# EAGLE design WS2803_7segs_discrete (EAGLE 7.1.0)
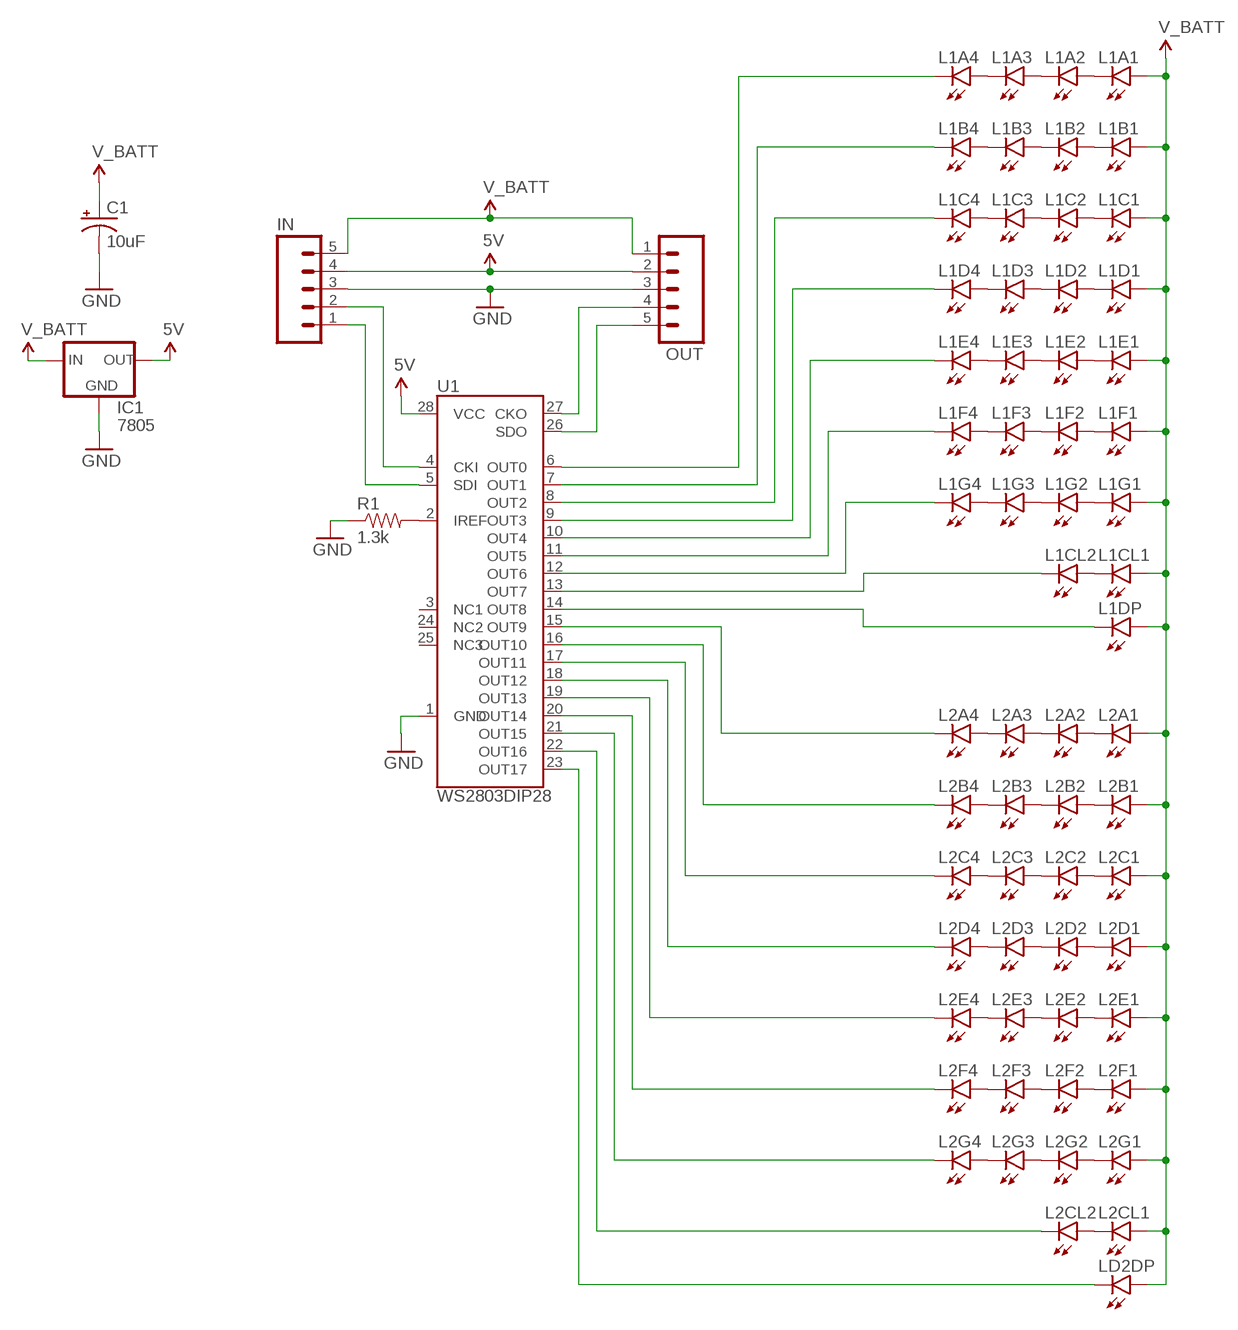
[diagram p0: schematic, sheet 1]

## Parts
C1  10uF  CAP_POLPTH2  [CPOL-RADIAL-10UF-25V]
IC1  7805  V_REG_78XXTO-92_FIXED  [TO-92]
IN  M05PTH  [1X05]
L1A1  LED5MM  [LED5MM]
L1A2  LED5MM  [LED5MM]
L1A3  LED5MM  [LED5MM]
L1A4  LED5MM  [LED5MM]
L1B1  LED5MM  [LED5MM]
L1B2  LED5MM  [LED5MM]
L1B3  LED5MM  [LED5MM]
L1B4  LED5MM  [LED5MM]
L1C1  LED5MM  [LED5MM]
L1C2  LED5MM  [LED5MM]
L1C3  LED5MM  [LED5MM]
L1C4  LED5MM  [LED5MM]
L1CL1  LED5MM  [LED5MM]
L1CL2  LED5MM  [LED5MM]
L1D1  LED5MM  [LED5MM]
L1D2  LED5MM  [LED5MM]
L1D3  LED5MM  [LED5MM]
L1D4  LED5MM  [LED5MM]
L1DP  LED5MM  [LED5MM]
L1E1  LED5MM  [LED5MM]
L1E2  LED5MM  [LED5MM]
L1E3  LED5MM  [LED5MM]
L1E4  LED5MM  [LED5MM]
L1F1  LED5MM  [LED5MM]
L1F2  LED5MM  [LED5MM]
L1F3  LED5MM  [LED5MM]
L1F4  LED5MM  [LED5MM]
L1G1  LED5MM  [LED5MM]
L1G2  LED5MM  [LED5MM]
L1G3  LED5MM  [LED5MM]
L1G4  LED5MM  [LED5MM]
L2A1  LED5MM  [LED5MM]
L2A2  LED5MM  [LED5MM]
L2A3  LED5MM  [LED5MM]
L2A4  LED5MM  [LED5MM]
L2B1  LED5MM  [LED5MM]
L2B2  LED5MM  [LED5MM]
L2B3  LED5MM  [LED5MM]
L2B4  LED5MM  [LED5MM]
L2C1  LED5MM  [LED5MM]
L2C2  LED5MM  [LED5MM]
L2C3  LED5MM  [LED5MM]
L2C4  LED5MM  [LED5MM]
L2CL1  LED5MM  [LED5MM]
L2CL2  LED5MM  [LED5MM]
L2D1  LED5MM  [LED5MM]
L2D2  LED5MM  [LED5MM]
L2D3  LED5MM  [LED5MM]
L2D4  LED5MM  [LED5MM]
L2E1  LED5MM  [LED5MM]
L2E2  LED5MM  [LED5MM]
L2E3  LED5MM  [LED5MM]
L2E4  LED5MM  [LED5MM]
L2F1  LED5MM  [LED5MM]
L2F2  LED5MM  [LED5MM]
L2F3  LED5MM  [LED5MM]
L2F4  LED5MM  [LED5MM]
L2G1  LED5MM  [LED5MM]
L2G2  LED5MM  [LED5MM]
L2G3  LED5MM  [LED5MM]
L2G4  LED5MM  [LED5MM]
LD2DP  LED5MM  [LED5MM]
OUT  M05PTH  [1X05]
R1  1.3k  RESISTORPTH-1/4W  [AXIAL-0.4]
U1  WS2803DIP28  [DIP28]

## Nets
5V: IC1.1(OUT) IN.4 OUT.2 U1.28(VCC)
GND: C1.2(-) IC1.2(GND) IN.3 OUT.3 R1.P$1 U1.1(GND)
N$1: IN.2 U1.4(CKI)
N$2: IN.1 U1.5(SDI)
N$3: OUT.4 U1.27(CKO)
N$4: OUT.5 U1.26(SDO)
N$5: L1A4.K(C) U1.6(OUT0)
N$6: L1B4.K(C) U1.7(OUT1)
N$7: L1C4.K(C) U1.8(OUT2)
N$8: L1D4.K(C) U1.9(OUT3)
N$9: L1E4.K(C) U1.10(OUT4)
N$10: L1F4.K(C) U1.11(OUT5)
N$11: L1G4.K(C) U1.12(OUT6)
N$12: L1CL2.K(C) U1.13(OUT7)
N$13: L1DP.K(C) U1.14(OUT8)
N$14: LD2DP.K(C) U1.23(OUT17)
N$15: L2CL2.K(C) U1.22(OUT16)
N$16: L2G4.K(C) U1.21(OUT15)
N$17: L2F4.K(C) U1.20(OUT14)
N$18: L2E4.K(C) U1.19(OUT13)
N$19: L2D4.K(C) U1.18(OUT12)
N$20: L2C4.K(C) U1.17(OUT11)
N$21: R1.P$2 U1.2(IREF)
N$22: L1A1.K(C) L1A2.A
N$23: L1A2.K(C) L1A3.A
N$24: L1A3.K(C) L1A4.A
N$25: L1B1.K(C) L1B2.A
N$26: L1B2.K(C) L1B3.A
N$27: L1B3.K(C) L1B4.A
N$28: L1C1.K(C) L1C2.A
N$29: L1C2.K(C) L1C3.A
N$30: L1C3.K(C) L1C4.A
N$31: L1D1.K(C) L1D2.A
N$32: L1D2.K(C) L1D3.A
N$33: L1D3.K(C) L1D4.A
N$34: L1E1.K(C) L1E2.A
N$35: L1E2.K(C) L1E3.A
N$36: L1E3.K(C) L1E4.A
N$37: L1F1.K(C) L1F2.A
N$38: L1F2.K(C) L1F3.A
N$39: L1F3.K(C) L1F4.A
N$40: L1G1.K(C) L1G2.A
N$41: L1G2.K(C) L1G3.A
N$42: L1G3.K(C) L1G4.A
N$43: L1CL1.K(C) L1CL2.A
N$44: L2B4.K(C) U1.16(OUT10)
N$45: L2A4.K(C) U1.15(OUT9)
N$46: L2A1.K(C) L2A2.A
N$47: L2A2.K(C) L2A3.A
N$48: L2A3.K(C) L2A4.A
N$49: L2B1.K(C) L2B2.A
N$50: L2B2.K(C) L2B3.A
N$51: L2B3.K(C) L2B4.A
N$52: L2C1.K(C) L2C2.A
N$53: L2C2.K(C) L2C3.A
N$54: L2C3.K(C) L2C4.A
N$55: L2D1.K(C) L2D2.A
N$56: L2D2.K(C) L2D3.A
N$57: L2D3.K(C) L2D4.A
N$58: L2E1.K(C) L2E2.A
N$59: L2E2.K(C) L2E3.A
N$60: L2E3.K(C) L2E4.A
N$61: L2F1.K(C) L2F2.A
N$62: L2F2.K(C) L2F3.A
N$63: L2F3.K(C) L2F4.A
N$64: L2G1.K(C) L2G2.A
N$65: L2G2.K(C) L2G3.A
N$66: L2G3.K(C) L2G4.A
N$67: L2CL1.K(C) L2CL2.A
V_BATT: C1.1(+) IC1.3(IN) IN.5 L1A1.A L1B1.A L1C1.A L1CL1.A L1D1.A L1DP.A L1E1.A L1F1.A L1G1.A L2A1.A L2B1.A L2C1.A L2CL1.A L2D1.A L2E1.A L2F1.A L2G1.A LD2DP.A OUT.1
Unconnected: U1.3(NC1) U1.24(NC2) U1.25(NC3)

## Library data of the parts
C1 = SparkFun-Capacitors:CAP_POL: Capacitor Polarized These are standard SMD and PTH capacitors. Normally 10uF, 47uF, and 100uF in electrolytic and tantalum varieties. Always verify the external diameter of the through hole cap, it varies with capacity, voltage, and manufacturer. The EIA devices should be standard.
IC1 = TylerLibrary:V_REG_78XX: Voltage Regulator Standard 7805 5V regulator. IGO (Input Ground Output). Spark Fun Electronics SKU : COM-00107
IN OUT = SparkFun-Connectors:M05: Header 5 Standard 5-pin 0.1" header. Use with straight break away headers (SKU : PRT-00116), right angle break away headers (PRT-00553), swiss pins (PRT-00743), machine pins (PRT-00117), and female headers (PRT-00115). Molex polarized connector foot print use with SKU : PRT-08230 with associated crimp pins and housings.
L1A1-L1A4 L1B1-L1B4 L1C1-L1C4 L1CL1 L1CL2 L1D1-L1D4 L1DP L1E1-L1E4 L1F1-L1F4 L1G1-L1G4 L2A1-L2A4 L2B1-L2B4 L2C1-L2C4 L2CL1 L2CL2 L2D1-L2D4 L2E1-L2E4 L2F1-L2F4 L2G1-L2G4 LD2DP = SparkFun-LED:LED: LEDs Standard schematic elements and footprints for 5mm, 3mm, 1206, and 0603 sized LEDs. 5mm - Spark Fun Electronics SKU : COM-00529 (and others)
R1 = SparkFun-Resistors:RESISTOR: Resistor Basic schematic elements and footprints for 0603, 1206, and PTH resistors.
U1 = WS2803:WS2803: WS2803 18 Channel Constant Current LED Driver with programmable PWM outputs.

## Net classes
1 heavy: width 1.778 mm

## Board
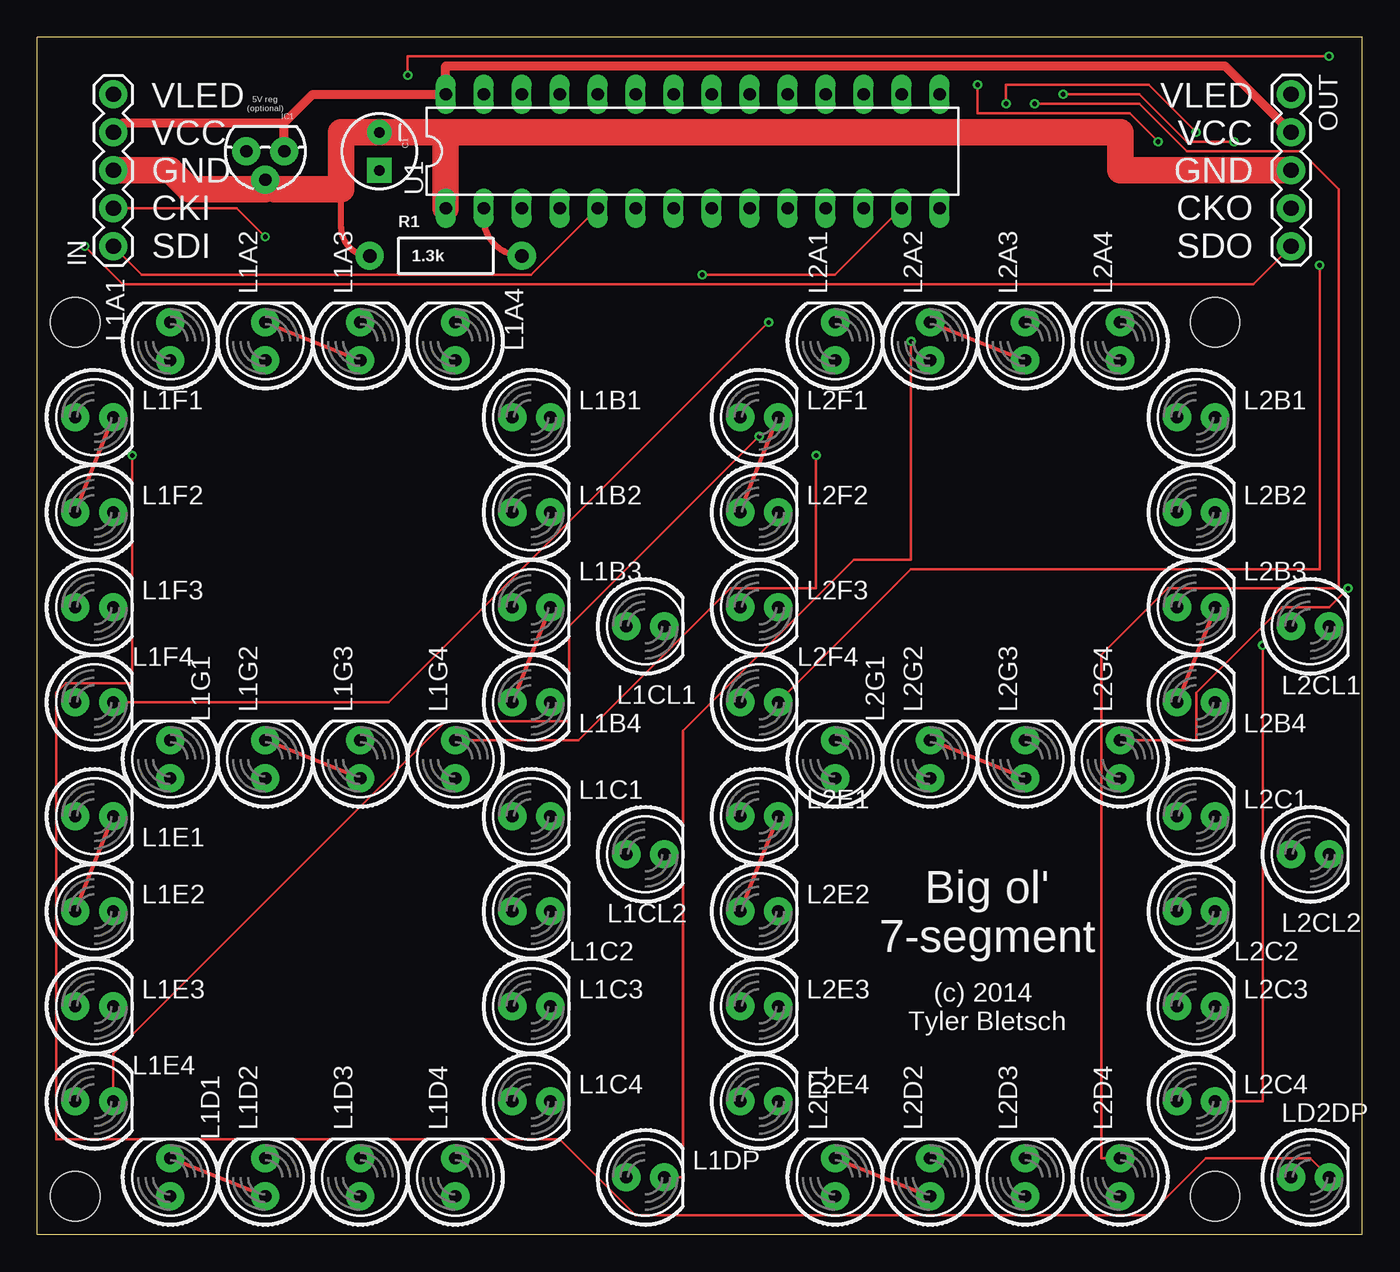
[diagram p1: board, top side]
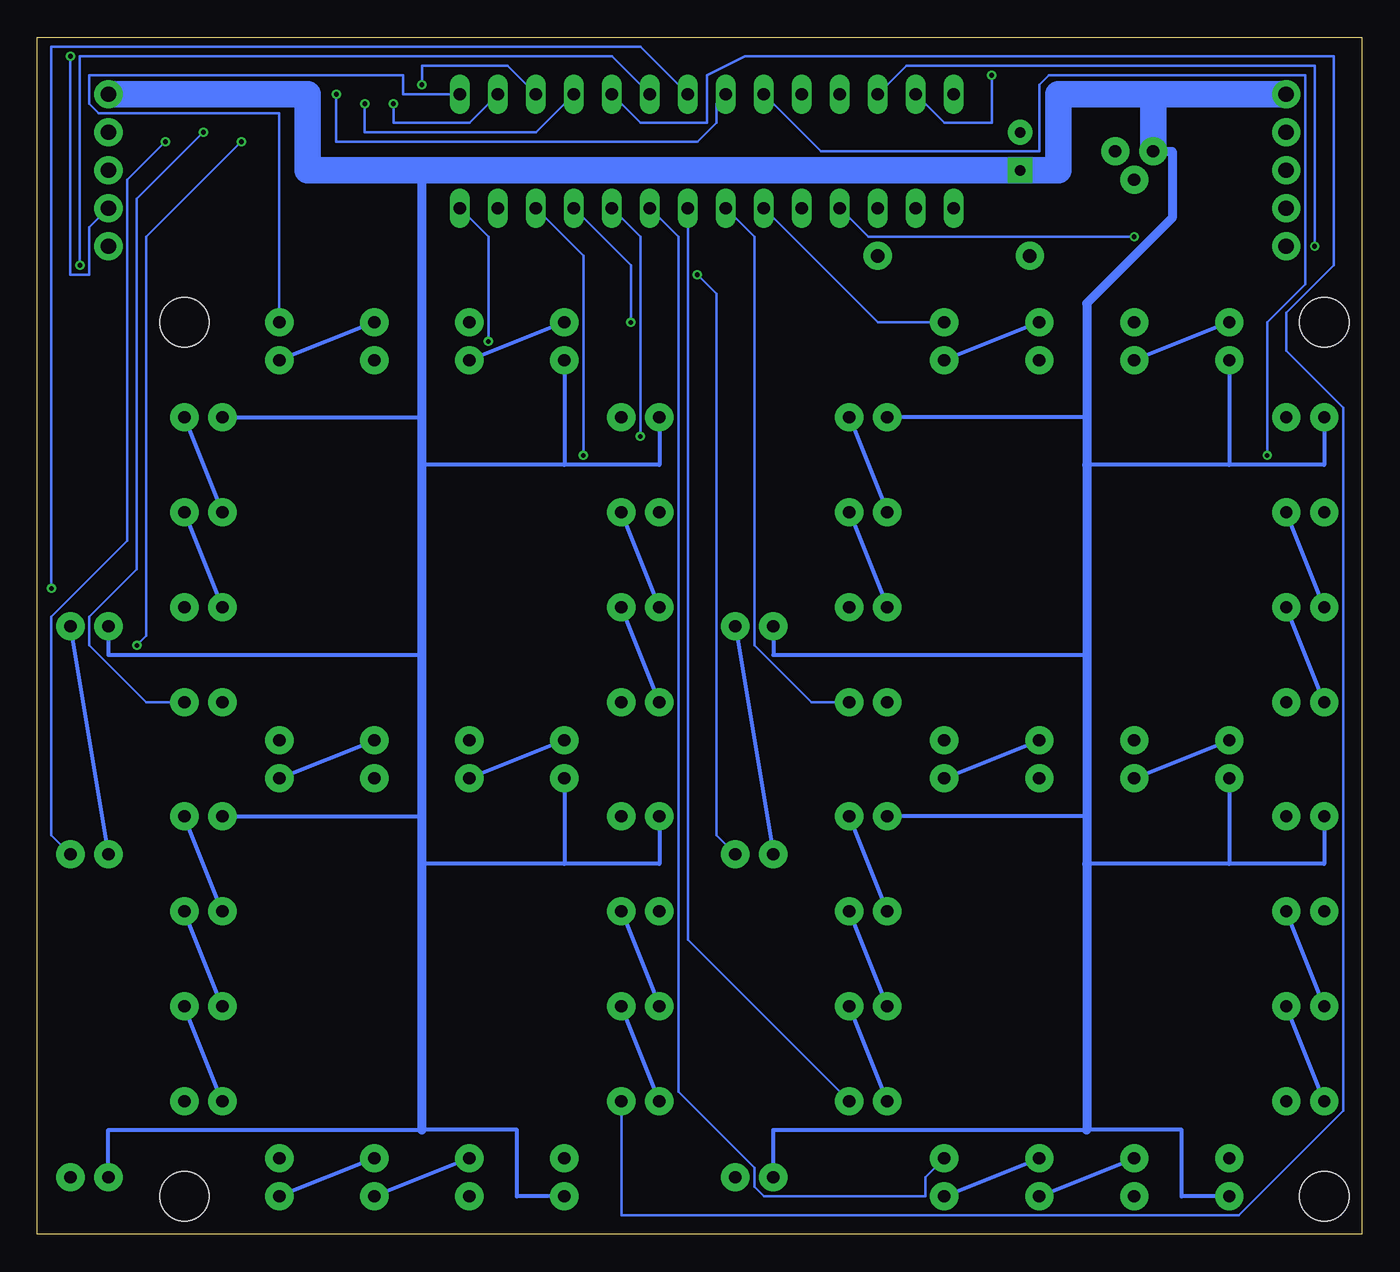
[diagram p2: board, bottom side, seen from below]

Size 88.57 x 80 mm. Coordinates in mm from the lower left corner, seen from the top.
Outline: 0,0 88.57,0 88.57,80 0,80 0,0
Copper layers (1*16): Top 0.035mm / dielectric 1.5mm / Bottom 0.035mm
Design rules "MakerStudio *": minimum track width 6mil, minimum drill 12mil, track to track 6mil, track to pad 6mil, pad to pad 6mil, via to via 6mil, smd to smd 0mil, copper to edge 20mil, drill to drill 20mil, minimum pad ring 10mil, minimum via ring 6mil, stop-mask expansion 2mil, vias tented up to drill 100mil, thermal gap 10mil
Holes 3.3 mm at 2.54,60.96 78.74,60.96 78.74,2.54 2.54,2.54

### Footprints (pad centres in the part's own frame; a part is rotated, then mirrored left to right if it is on the bottom)
CPOL-RADIAL-10UF-25V = drill 0.7 pad 1.651 square: 1 1.27,0 | drill 0.7 pad 1.651: 2 -1.27,0
TO-92 = drill 0.813 pad 1.88: 1 -1.27,0; 2 0,1.905; 3 1.27,0
1X05 = drill 1.016 pad 1.88: 1 0,0; 2 2.54,0; 3 5.08,0; 4 7.62,0; 5 10.16,0
LED5MM = drill 0.813 pad 1.88: A -1.27,0; K 1.27,0
AXIAL-0.4 = drill 0.9 pad 1.88: P$1 -5.08,0; P$2 5.08,0
DIP28 = drill 0.813 long: 1 -15.24,-3.81; 2 -12.7,-3.81; 3 -10.16,-3.81; 4 -7.62,-3.81; 5 -5.08,-3.81; 6 -2.54,-3.81; 7 0,-3.81; 8 2.54,-3.81; 9 5.08,-3.81; 10 7.62,-3.81; 11 10.16,-3.81; 12 12.7,-3.81; 13 15.24,-3.81; 14 17.78,-3.81; 15 17.78,3.81; 16 15.24,3.81; 17 12.7,3.81; 18 10.16,3.81; 19 7.62,3.81; 20 5.08,3.81; 21 2.54,3.81; 22 0,3.81; 23 -2.54,3.81; 24 -5.08,3.81; 25 -7.62,3.81; 26 -10.16,3.81; 27 -12.7,3.81; 28 -15.24,3.81

### Placement (x,y rotation side)
C1  22.86,72.39 270 top
IC1  15.24,72.39 180 top
IN  5.08,66.04 90 top
L1A1  8.89,59.69 90 top
L1A2  15.24,59.69 90 top
L1A3  21.59,59.69 90 top
L1A4  27.94,59.69 90 top
L1B1  33.02,54.61 0 top
L1B2  33.02,48.26 0 top
L1B3  33.02,41.91 0 top
L1B4  33.02,35.56 0 top
L1C1  33.02,27.94 0 top
L1C2  33.02,21.59 0 top
L1C3  33.02,15.24 0 top
L1C4  33.02,8.89 0 top
L1CL1  40.64,40.64 0 top
L1CL2  40.64,25.4 0 top
L1D1  8.89,3.81 90 top
L1D2  15.24,3.81 90 top
L1D3  21.59,3.81 90 top
L1D4  27.94,3.81 90 top
L1DP  40.64,3.81 0 top
L1E1  3.81,27.94 0 top
L1E2  3.81,21.59 0 top
L1E3  3.81,15.24 0 top
L1E4  3.81,8.89 0 top
L1F1  3.81,54.61 0 top
L1F2  3.81,48.26 0 top
L1F3  3.81,41.91 0 top
L1F4  3.81,35.56 0 top
L1G1  8.89,31.75 90 top
L1G2  15.24,31.75 90 top
L1G3  21.59,31.75 90 top
L1G4  27.94,31.75 90 top
L2A1  53.34,59.69 90 top
L2A2  59.69,59.69 90 top
L2A3  66.04,59.69 90 top
L2A4  72.39,59.69 90 top
L2B1  77.47,54.61 0 top
L2B2  77.47,48.26 0 top
L2B3  77.47,41.91 0 top
L2B4  77.47,35.56 0 top
L2C1  77.47,27.94 0 top
L2C2  77.47,21.59 0 top
L2C3  77.47,15.24 0 top
L2C4  77.47,8.89 0 top
L2CL1  85.09,40.64 0 top
L2CL2  85.09,25.4 0 top
L2D1  53.34,3.81 90 top
L2D2  59.69,3.81 90 top
L2D3  66.04,3.81 90 top
L2D4  72.39,3.81 90 top
L2E1  48.26,27.94 0 top
L2E2  48.26,21.59 0 top
L2E3  48.26,15.24 0 top
L2E4  48.26,8.89 0 top
L2F1  48.26,54.61 0 top
L2F2  48.26,48.26 0 top
L2F3  48.26,41.91 0 top
L2F4  48.26,35.56 0 top
L2G1  53.34,31.75 90 top
L2G2  59.69,31.75 90 top
L2G3  66.04,31.75 90 top
L2G4  72.39,31.75 90 top
LD2DP  85.09,3.81 0 top
OUT  83.82,76.2 270 top
R1  27.3,65.41 0 top
U1  42.55,72.39 0 top

### Tracks (layer width: path | path; a pad name or v marks a point on that pad's centre or on a via)
5V
  Top 0.61: IN.4 5.71,74.3 16.51,74.3 | IC1.1 16.51,74.3 | 16.51,74.3 18.41,76.2 U1.28 27.3,78.11 79.38,78.11 OUT.2
GND
  Top 0.406: R1.P$1 arc-90 20.32,67.31 20.32,69.85
  Top 1.778: IN.3 8.89,71.12 10.16,69.85 15.24,69.85 IC1.2 15.88,69.85 20.32,69.85 20.32,73.66 C1.2 27.3,73.66 | 27.3,73.66 72.39,73.66 72.39,71.12 OUT.3 | U1.1 27.3,73.66
N$1  (via drill 0.3)
  Top 0.152: v15.24,66.67 13.34,68.58 IN.2
  Bottom 0.152: U1.4 33.02,66.67 v15.24,66.67
N$2
  Top 0.152: U1.5 33.02,64.14 6.99,64.14 IN.1
N$3  (via drill 0.3)
  Top 0.152: v24.77,77.47 24.77,78.74 v86.36,78.74
  Bottom 0.152: U1.27 27.94,74.3 24.77,74.3 v24.77,77.47 | v86.36,78.74 86.36,64.14 85.09,64.14 85.09,67.31 OUT.4
N$4  (via drill 0.3)
  Top 0.152: v3.17,66.04 5.71,63.5 81.28,63.5 OUT.5
  Bottom 0.152: U1.26 30.48,78.11 3.17,78.11 v3.17,66.04
N$5
  Bottom 0.152: U1.6 32.38,60.96 L1A4.K
N$6
  Bottom 0.152: U1.7 40.64,66.67 40.64,39.37 36.83,35.56 L1B4.K
N$7
  Bottom 0.152: U1.8 45.09,19.68 L1C4.K
N$8
  Bottom 0.152: U1.9 45.72,66.67 45.72,9.53 40.64,4.45 40.64,3.17 40.01,2.54 29.21,2.54 29.21,3.81 L1D4.K
N$9  (via drill 0.3)
  Top 0.152: v48.26,53.34 35.56,40.64 35.56,34.29 27.3,34.29 5.08,12.06 L1E4.K
  Bottom 0.152: U1.10 48.26,66.67 v48.26,53.34
N$10  (via drill 0.3)
  Top 0.152: v48.9,60.96 23.5,35.56 L1F4.K
  Bottom 0.152: U1.11 48.9,64.77 v48.9,60.96
N$11  (via drill 0.3)
  Top 0.152: v52.07,52.07 52.07,43.18 46.35,43.18 36.2,33.02 L1G4.K
  Bottom 0.152: U1.12 52.07,65.41 v52.07,52.07
N$12  (via drill 0.3)
  Top 0.152: U1.13 53.34,64.14 v44.45,64.14
  Bottom 0.152: v44.45,64.14 43.18,62.87 43.18,26.67 L1CL2.K
N$13  (via drill 0.3)
  Top 0.152: v58.42,59.69 58.42,45.09 54.61,45.09 43.18,33.66 43.18,3.81 L1DP.K
  Bottom 0.152: U1.14 58.42,66.67 v58.42,59.69
N$14  (via drill 0.3)
  Top 0.152: v6.35,52.07 6.35,36.83 1.91,36.83 1.27,36.2 1.27,6.35 34.92,6.35 40.01,1.27 74.3,1.27 78.11,5.08 85.09,5.08 LD2DP.K
  Bottom 0.152: U1.23 36.2,72.39 21.59,72.39 21.59,76.83 20.95,77.47 3.81,77.47 3.81,63.5 6.35,60.96 v6.35,52.07
N$15  (via drill 0.3)
  Top 0.152: v68.58,76.2 73.66,76.2 76.83,73.03 v80.01,73.03
  Bottom 0.152: U1.22 43.18,75.56 43.18,74.3 44.45,73.03 68.58,73.03 v68.58,76.2 | v80.01,73.03 82.55,70.48 82.55,46.35 87.63,41.27 87.63,26.67 L2CL2.K
N$16  (via drill 0.3)
  Top 0.152: v87.63,43.18 86.36,41.91 83.19,41.91 77.47,36.2 77.47,33.02 L2G4.K
  Bottom 0.152: U1.21 48.26,79.38 87.63,79.38 v87.63,43.18
N$17  (via drill 0.3)
  Top 0.152: v85.72,64.77 85.72,44.45 58.42,44.45 L2F4.K
  Bottom 0.152: U1.20 50.16,78.74 85.72,78.74 v85.72,64.77
N$18
  Bottom 0.152: U1.19 48.26,74.3 43.81,74.3 43.81,77.47 41.27,78.74 1.91,78.74 1.91,64.77 5.08,61.59 5.08,59.05 1.27,55.24 1.27,8.26 8.26,1.27 49.53,1.27 L2E4.K
N$19  (via drill 0.3)
  Top 0.152: v66.67,75.56 73.66,75.56 76.83,72.39 84.45,72.39 87,69.85 87,43.18 75.56,43.18 71.12,38.73 71.12,5.08 L2D4.K
  Bottom 0.152: U1.18 55.24,73.66 66.67,73.66 v66.67,75.56
N$20  (via drill 0.3)
  Top 0.152: v62.87,76.83 62.87,74.93 73.03,74.93 v74.93,73.03 | v81.92,39.37 81.92,8.89 L2C4.K
  Bottom 0.152: U1.17 57.15,78.11 62.87,78.11 v62.87,76.83 | v74.93,73.03 81.28,66.67 81.28,40.01 v81.92,39.37
N$21
  Top 0.406: R1.P$2 arc-90 29.84,67.94 U1.2
N$22
  Bottom 0.254: L1A1.K L1A2.A
N$23
  Top 0.254: L1A2.K L1A3.A
N$24
  Bottom 0.254: L1A3.K L1A4.A
N$25
  Bottom 0.254: L1B1.K L1B2.A
N$26
  Bottom 0.254: L1B2.K L1B3.A
N$27
  Top 0.254: L1B3.K L1B4.A
N$28
  Bottom 0.254: L1C2.A L1C1.K
N$29
  Bottom 0.254: L1C3.A L1C2.K
N$30
  Bottom 0.254: L1C4.A L1C3.K
N$31
  Top 0.254: L1D2.A L1D1.K
N$32
  Bottom 0.254: L1D3.A L1D2.K
N$33
  Bottom 0.254: L1D4.A L1D3.K
N$34
  Top 0.254: L1E2.A L1E1.K
N$35
  Bottom 0.254: L1E3.A L1E2.K
N$36
  Bottom 0.254: L1E4.A L1E3.K
N$37
  Top 0.254: L1F2.A L1F1.K
N$38
  Bottom 0.254: L1F3.A L1F2.K
N$39
  Bottom 0.254: L1F4.A L1F3.K
N$40
  Bottom 0.254: L1G2.A L1G1.K
N$41
  Top 0.254: L1G3.A L1G2.K
N$42
  Bottom 0.254: L1G4.A L1G3.K
N$43
  Bottom 0.254: L1CL1.K L1CL2.A
N$44  (via drill 0.3)
  Top 0.152: v64.77,75.56 64.77,76.83 74.3,76.83 v77.47,73.66
  Bottom 0.152: U1.16 59.69,74.3 64.77,74.3 v64.77,75.56 | v77.47,73.66 81.92,69.22 81.92,44.45 85.09,41.27 85.09,39.37 81.28,35.56 L2B4.K
N$45
  Bottom 0.152: U1.15 64.14,76.2 64.14,77.47 85.09,77.47 85.09,75.56 84.45,74.93 72.39,74.93 L2A4.K
N$46
  Bottom 0.254: L2A1.K L2A2.A
N$47
  Top 0.254: L2A2.K L2A3.A
N$48
  Bottom 0.254: L2A3.K L2A4.A
N$49
  Bottom 0.254: L2B1.K L2B2.A
N$50
  Bottom 0.254: L2B2.K L2B3.A
N$51
  Top 0.254: L2B3.K L2B4.A
N$52
  Bottom 0.254: L2C2.A L2C1.K
N$53
  Bottom 0.254: L2C3.A L2C2.K
N$54
  Bottom 0.254: L2C4.A L2C3.K
N$55
  Top 0.254: L2D1.K L2D2.A
N$56
  Bottom 0.254: L2D2.K L2D3.A
N$57
  Bottom 0.254: L2D3.K L2D4.A
N$58
  Top 0.254: L2E1.K L2E2.A
N$59
  Bottom 0.254: L2E2.K L2E3.A
N$60
  Bottom 0.254: L2E4.A L2E3.K
N$61
  Top 0.254: L2F2.A L2F1.K
N$62
  Bottom 0.254: L2F3.A L2F2.K
N$63
  Bottom 0.254: L2F4.A L2F3.K
N$64
  Bottom 0.254: L2G1.K L2G2.A
N$65
  Top 0.254: L2G3.A L2G2.K
N$66
  Bottom 0.254: L2G4.A L2G3.K
N$67
  Bottom 0.254: L2CL1.K L2CL2.A
V_BATT
  Bottom 0.254: L1D1.A 12.06,2.54 12.06,6.99 18.41,6.99 39.37,6.99 L1DP.A | L1E1.A 2.54,24.77 8.89,24.77 | 8.89,24.77 18.41,24.77 18.41,27.94 L1C1.A | L1G1.A 8.89,24.77 | L1F1.A 2.54,51.44 8.89,51.44 | 8.89,51.44 18.41,51.44 18.41,54.61 L1B1.A | L1A1.A 8.89,51.44 | L2A1.A 53.34,51.44 | 53.34,51.44 62.87,51.44 | L2B1.A 62.87,54.61 | L2D1.A 56.52,2.54 56.52,6.99 62.87,6.99 83.82,6.99 LD2DP.A | L2C1.A 62.87,27.94 | L2E1.A 46.99,24.77 53.34,24.77 | 53.34,24.77 62.87,24.77 | L2G1.A 53.34,24.77 | L1CL1.A 39.37,38.73 18.41,38.73 | L2CL1.A 83.82,38.73 62.87,38.73 | L2F1.A 46.99,51.44 53.34,51.44
  Bottom 0.61: 18.41,6.99 18.41,24.77 18.41,38.73 18.41,51.44 18.41,62.23 12.7,67.94 12.7,72.39 IC1.3 | 62.23,71.12 62.87,71.12 62.87,54.61 62.87,51.44 62.87,38.73 62.87,27.94 62.87,24.77 62.87,6.99
  Bottom 1.778: IN.5 13.97,76.2 | IC1.3 13.97,76.2 | 13.97,76.2 20.32,76.2 20.32,71.12 C1.1 62.23,71.12 70.48,71.12 70.48,76.2 OUT.1

### Text on the board
tPlace: (c) 2014 / Tyler Bletsch
tNames: 5V reg / (optional) | VLED / VCC / GND / CKI / SDI | VLED / VCC / GND / CKO / SDO | Big ol' / 7-segment